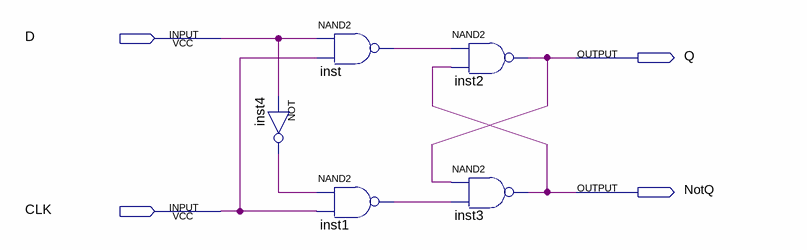
[diagram p0: schematic sheet]
// Quartus schematic DFlipFlop.bdf as structural Verilog: 5 symbols, 4 pins
module DFlipFlop (
  input  D,
  input  CLK,
  output Q,
  output NotQ
);

  wire inst1_out, inst4_out, inst_out;

  not inst4 (inst4_out, D);
  nand inst (inst_out, D, CLK);
  nand inst1 (inst1_out, inst4_out, CLK);
  nand inst2 (Q, inst_out, NotQ);
  nand inst3 (NotQ, Q, inst1_out);
endmodule
